# Altium project Wiznet5500_Project.PrjPcb
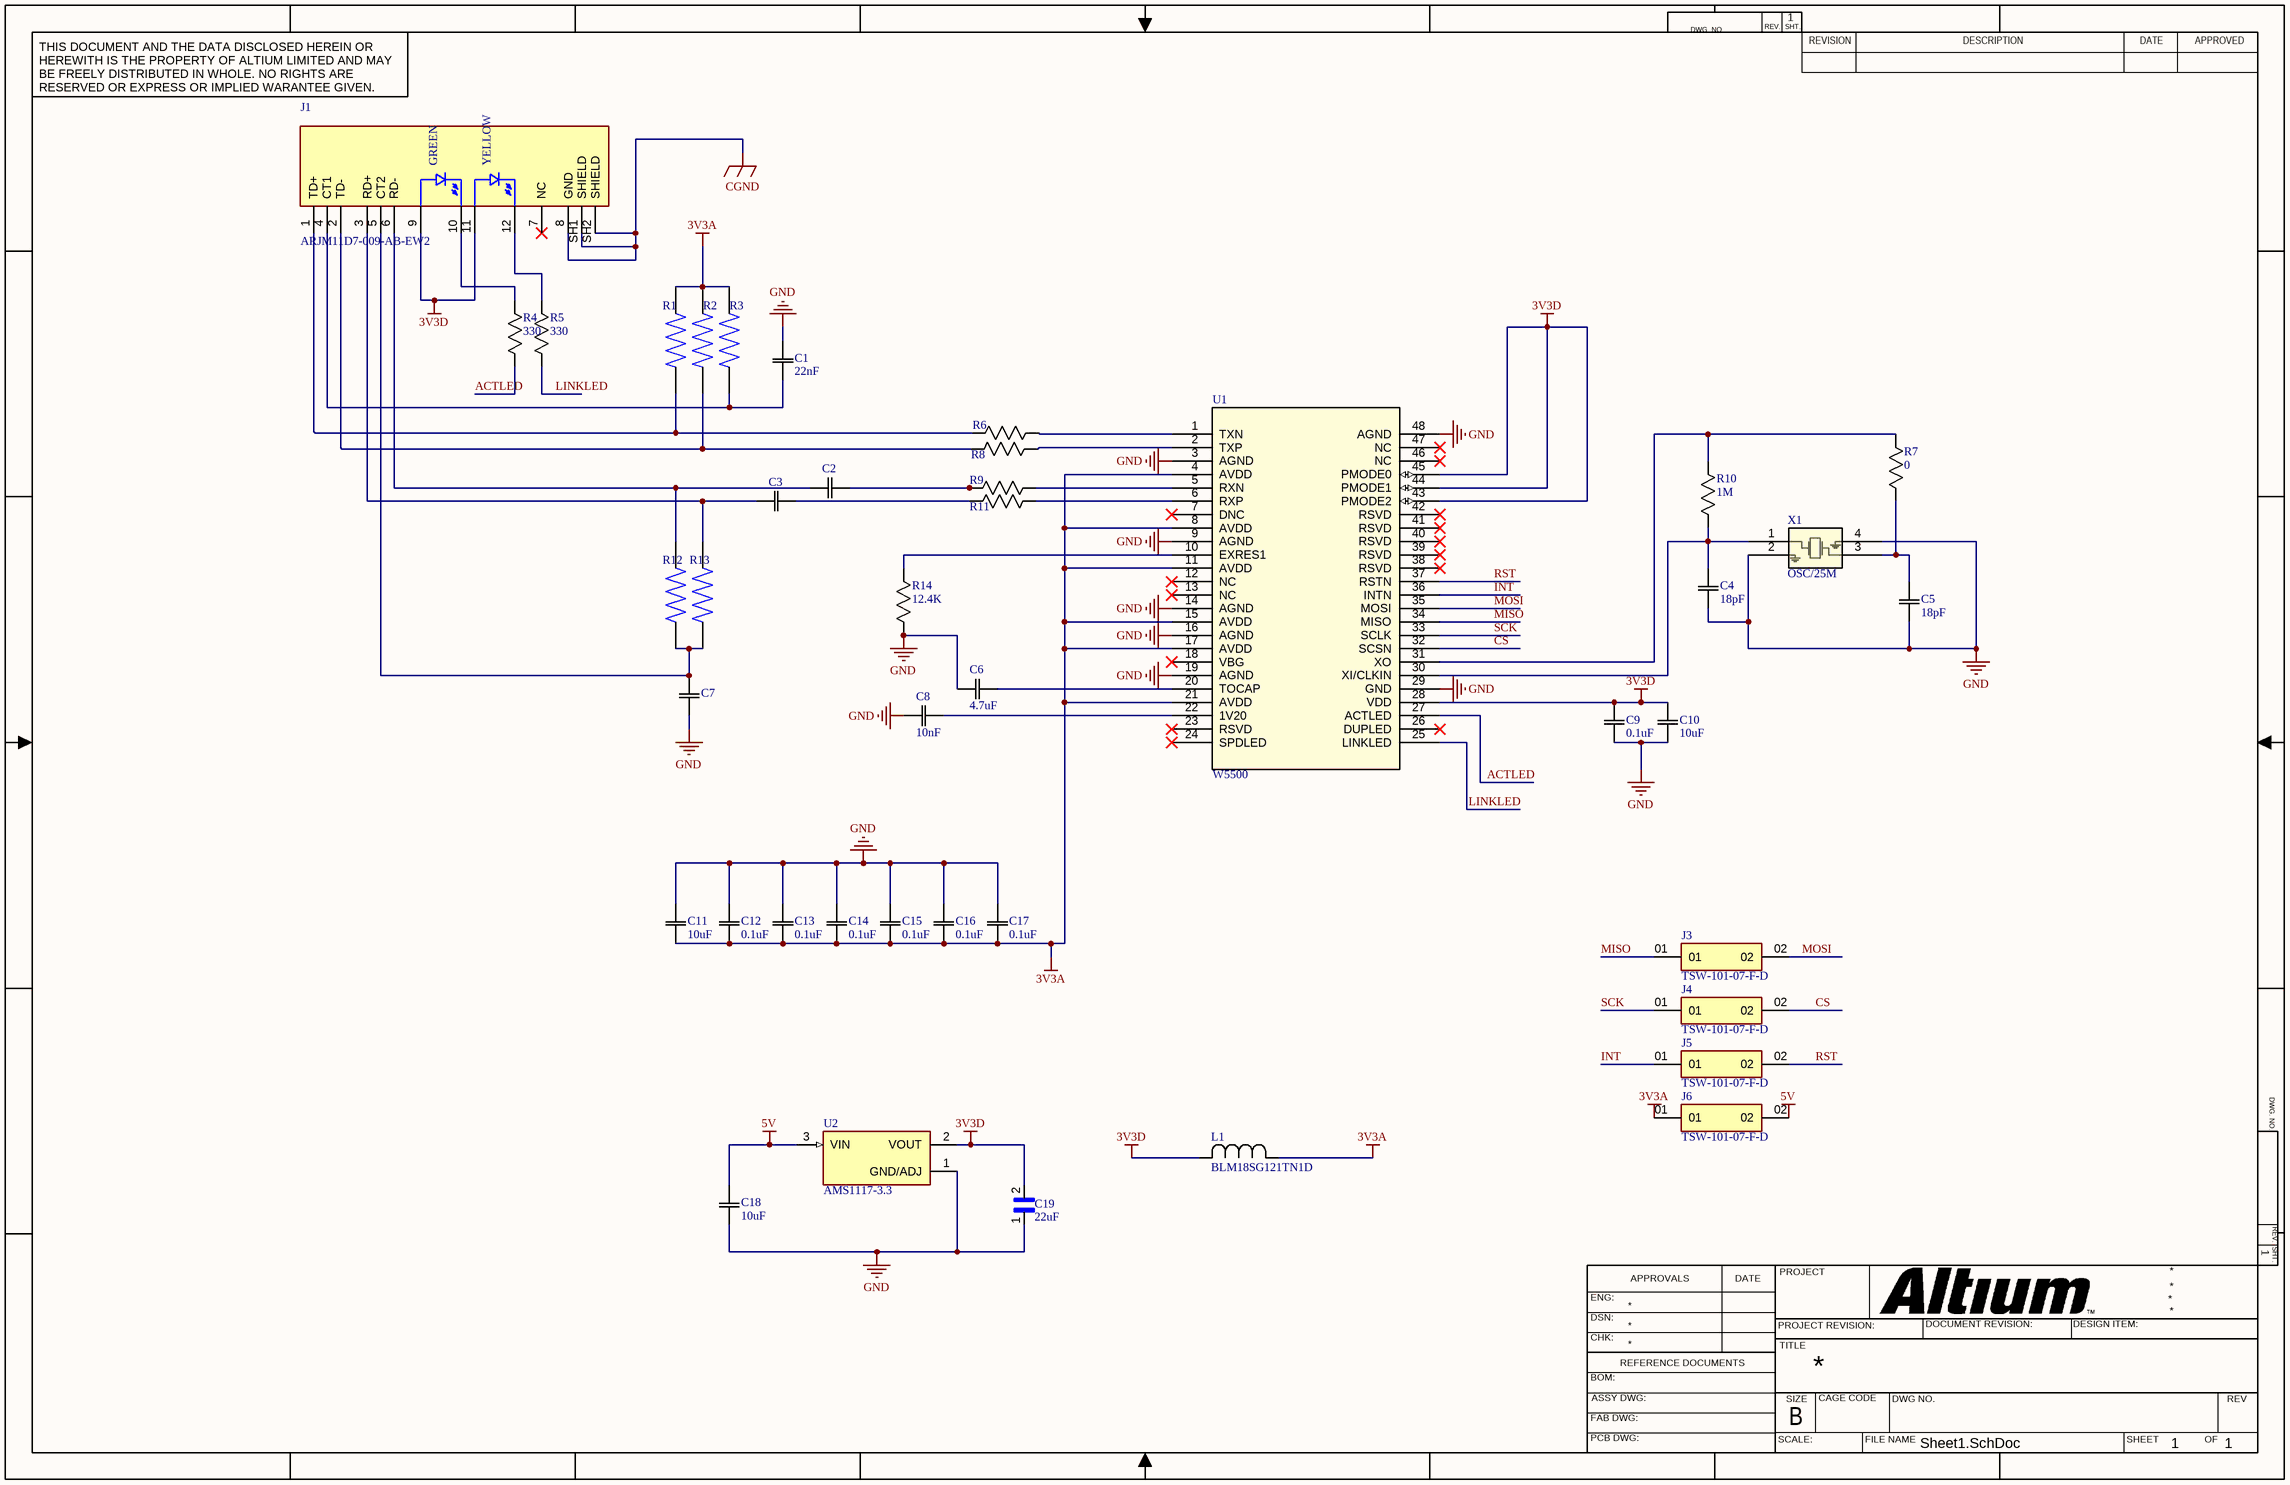
[diagram p0: Sheet1.SchDoc]
1 sheet, 42 parts. Net scope: global (net labels, ports and power ports of the same name join across sheets).
Board file: PCB1.PcbDoc

## Sheet Sheet1.SchDoc
size 431 x 279 mm; SheetNumber: 1; SheetTotal: 1

### Parts
C1  22nF  [CAP_2012_TDK]
C2  CAP_6.8nfar_805pkg  [CC0805N_YAG]  (value not drawn)
C3  CAP_6.8nfar_805pkg  [CC0805N_YAG]  (value not drawn)
C4  18pF  [CAP_CC0805_YAG]
C5  18pF  [CAP_CC0805_YAG]
C6  4.7uF  [CAP_CL21_SAM]
C7  CAP_10nfar_805pkg  [CAP_CL21_SAM]  (value not drawn)
C8  10nF  [CAP_CL21_SAM]
C9  0.1uF  [CC0805N_YAG]
C10  10uF  [CAP_CL21_SAM]
C11  10uF  [CAP_CL21_SAM]
C12  0.1uF  [CC0805N_YAG]
C13  0.1uF  [CC0805N_YAG]
C14  0.1uF  [CC0805N_YAG]
C15  0.1uF  [CC0805N_YAG]
C16  0.1uF  [CC0805N_YAG]
C17  0.1uF  [CC0805N_YAG]
C18  10uF  [CAP_CL21_SAM]
C19  22uF  [CAPC3225X280N]
J1  ARJM11D7-009-AB-EW2  [ABRACON_ARJM11D7-009-AB-EW2]
J3  TSW-101-07-F-D  [SAMTEC_TSW-101-07-F-D]
J4  TSW-101-07-F-D  [SAMTEC_TSW-101-07-F-D]
J5  TSW-101-07-F-D  [SAMTEC_TSW-101-07-F-D]
J6  TSW-101-07-F-D  [SAMTEC_TSW-101-07-F-D]
L1  BLM18SG121TN1D  [IND_BLM18_0603_MUR]
R1  RES_49.9ohm_805pkg  [RESC2012X60N]  (value not drawn)
R2  RES_49.9ohm_805pkg  [RESC2012X60N]  (value not drawn)
R3  RES_49.9ohm_805pkg  [RESC2012X60N]  (value not drawn)
R4  330  [RES_CRCW_0805_VIS]
R5  330  [RES_CRCW_0805_VIS]
R6  RES_0ohm_805pkg  [RES_CRCW_0805_VIS]  (value not drawn)
R7  0  [RES_CRCW_0805_VIS]
R8  RES_0ohm_805pkg  [RES_CRCW_0805_VIS]  (value not drawn)
R9  RES_0ohm_805pkg  [RES_CRCW_0805_VIS]  (value not drawn)
R10  1M  [RES_CRCW_0805]
R11  RES_0ohm_805pkg  [RES_CRCW_0805_VIS]  (value not drawn)
R12  RES_49.9ohm_805pkg  [RESC2012X60N]  (value not drawn)
R13  RES_49.9ohm_805pkg  [RESC2012X60N]  (value not drawn)
R14  12.4K  [RES_CRCW_0805]
U1  W5500  [48LQFP_W5500_WIZ]
U2  AMS1117-3.3  [SOT229P700X180-4N]
X1  OSC/25M  [ABM8G_ABR]

### Nets
3V3A: C11.2 C12.2 C13.2 C14.2 C15.2 C16.2 C17.2 J6.01 L1.1 R1.2 R2.2 R3.2 U1.4(AVDD) U1.8(AVDD) U1.11(AVDD) U1.15(AVDD) U1.17(AVDD) U1.21(AVDD)
3V3D: C9.1 C10.1 C19.2 J1.9 J1.11 L1.2 U1.28(VDD) U1.43(PMODE2) U1.44(PMODE1) U1.45(PMODE0) U2.2(VOUT)
5V: C18.2 J6.02 U2.3(VIN)
CGND: J1.8(GND) J1.SH1(SHIELD) J1.SH2(SHIELD)
GND: C1.2 C4.1 C5.1 C6.1 C7.1 C8.1 C9.2 C10.2 C11.1 C12.1 C13.1 C14.1 C15.1 C16.1 C17.1 C18.1 C19.1 R14.2 U1.3(AGND) U1.9(AGND) U1.14(AGND) U1.16(AGND) U1.19(AGND) U1.29(GND) U1.48(AGND) U2.1(GND/ADJ) X1.2 X1.4
ACTLED: R4.1 U1.27(ACTLED)
CS: J4.02 U1.32(SCSN)
INT: J5.01 U1.36(INTN)
LINKLED: R5.1 U1.25(LINKLED)
MISO: J3.01 U1.34(MISO)
MOSI: J3.02 U1.35(MOSI)
RST: J5.02 U1.37(RSTN)
SCK: J4.01 U1.33(SCLK)
NetC1_1: C1.1 J1.4(CT1) R3.1
NetC2_1: C2.1 J1.6(RD-) R12.2
NetC2_2: C2.2 R9.2
NetC3_1: C3.1 J1.3(RD+) R13.2
NetC3_2: C3.2 R11.2
NetC4_2: C4.2 R10.2 U1.30(XI/CLKIN) X1.1
NetC5_2: C5.2 R7.2 X1.3
NetC6_2: C6.2 U1.20(TOCAP)
NetC7_2: C7.2 J1.5(CT2) R12.1 R13.1
NetC8_2: C8.2 U1.22(1V20)
NetJ1_1: J1.1(TD+) R1.1 R6.2
NetJ1_2: J1.2(TD-) R2.1 R8.2
NetJ1_10: J1.10 R4.2
NetJ1_12: J1.12 R5.2
NetR6_1: R6.1 U1.1(TXN)
NetR7_1: R7.1 R10.1 U1.31(XO)
NetR8_1: R8.1 U1.2(TXP)
NetR9_1: R9.1 U1.5(RXN)
NetR11_1: R11.1 U1.6(RXP)
NetR14_1: R14.1 U1.10(EXRES1)

Not connected (* = marked no-connect by the designer): J1 7(NC)*; U1 7(DNC)* 12(NC)* 13(NC)* 18(VBG)* 23(RSVD)* 24(SPDLED)* 26(DUPLED)* 38(RSVD)* 39(RSVD)* 40(RSVD)* 41(RSVD)* 42(RSVD)* 46(NC)* 47(NC)*

### Notes on the sheet
- DWG. NO.
- REV.
- SHT.
- THIS DOCUMENT AND THE DATA DISCLOSED HEREIN OR HEREWITH IS THE PROPERTY OF ALTIUM LIMITED AND MAY BE FREELY DISTRIBUTED IN WHOLE. NO RIGHTS ARE RESERVED OR EXPRESS OR IMPLIED WARANTEE GIVEN.
- REVISION
- DESCRIPTION
- DATE
- APPROVED
- ENG:
- APPROVALS
- PROJECT
- DSN:
- CHK:
- REFERENCE DOCUMENTS
- PROJECT REVISION:
- TITLE
- DOCUMENT REVISION:
- DESIGN ITEM:
- BOM:
- FAB DWG:
- PCB DWG:
- ASSY DWG:
- SCALE:
- SIZE
- B
- CAGE CODE
- FILE NAME
- DWG NO.
- SHEET
- OF
- REV
- (in symbol ARJM11D7-009-AB-EW2) GREEN; YELLOW

### Library data of the parts
C1 = CAP_22nfar_805pkg: No Description Available; Mfr_Name: TDK
C2 C3 = CAP_6.8nfar_805pkg: No Description Available; Mfr_Name: Yageo
C4 C5 = CAP_18pfar_805pkg: No Description Available; Mfr_Name: Yageo
C6 = CAP_4.7ufar_805pkg: No Description Available; Mfr_Name: Samsung
C7 C8 = CAP_10nfar_805pkg: No Description Available; Mfr_Name: Samsung
C9 C12-C17 = CAP_0.1ufar_805pkg: No Description Available; Mfr_Name: Yageo
C10 C11 C18 = CAP_10ufar_805pkg: No Description Available; Mfr_Name: Samsung
C19 = GCJ32ER71C226KE01L: SMD Capacitor X7R_EIA_ with Capacitance: 22uF Tol. 10%. Rated Voltage: 16Vdc; MF: Murata; Price: None; Availability: Unavailable; MP: GCJ32ER71C226KE01L; Package: 3225 Murata; SnapEDA_Link: https://www.snapeda.com/parts/GCJ32ER71C226KE01L/Murata/view-part/4383175/?ref=snap; Value: *
J1 = ARJM11D7-009-AB-EW2: MF: {'manufacturer': u'Abracon LLC'}; Package: None; Price: None; Value: *; MP: ARJM11D7-009-AB-EW2; Availability: Unavailable
J3-J6 = TSW-101-07-F-D: MF: Samtec; Package: None; Availability: Unavailable; Value: *; MP: TSW-101-07-F-D; Price: None
L1 = BLM18SG121TN1D: No Description Available; Mfr_Name: Murata
R1-R3 R12 R13 = RES_49.9ohm_805pkg: 49.9 Ohms Â±1% 0.125W, 1/8W Chip Resistor 0805 _2012 Metric_ Thick Film; MP: CRCW080549R9FKEAC; MF: Vishay; Value: *; Package: 2012 Vishay; Digi-Key_Purchase_URL: https://www.digikey.tn/product-detail/en/vishay-dale/CRCW080549R9FKEAC/541-4144-1-ND/7928827?utm_source=snapeda&utm_medium=aggregator&utm_campaign=symbol; Digi-Key_Part_Number: 541-4144-1-ND; SnapEDA_Link: https://www.snapeda.com/parts/CRCW080549R9FKEAC/Vishay/view-part/4164271/?ref=snap
R4 R5 = RES_330ohm_805pkg: No Description Available; Mfr_Name: Vishay
R6-R9 R11 = RES_0ohm_805pkg: No Description Available; Mfr_Name: Vishay
R10 = RES_1Mohm_805pkg: No Description Available; Mfr_Name: Vishay
R14 = RES_12.4Kohm_805pkg: No Description Available; Mfr_Name: Vishay
U1 = W5500: No Description Available; Mfr_Name: WIZnet; RefDes: RefDes; Type: Type
U2 = AMS1117-3.3: Sot223/Pkg 1-Amp 3.3-Volt Low Drop Out Voltage Regulatator; MF: Advanced Monolithic Systems; Package: SOT-223 Seeed Technology; Value: *; Check_prices: https://www.snapeda.com/parts/AMS1117-3.3/Advanced+Monolithic+Systems/view-part/?ref=eda; Price: None; Availability: Not in stock; MP: AMS1117-3.3; SnapEDA_Link: https://www.snapeda.com/parts/AMS1117-3.3/Advanced+Monolithic+Systems/view-part/?ref=snap
X1 = ABM8G-25.000MHZ-4Y-T3: No Description Available; Mfr_Name: Abracon; Type: Crystals; RefDes: RefDes